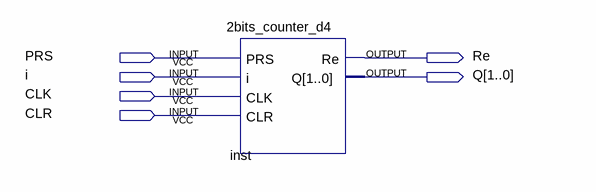
[diagram p0: schematic sheet]
// Quartus schematic test2.bdf as structural Verilog: 1 symbols, 6 pins
module test2 (
  input  PRS,
  input  i,
  input  CLK,
  input  CLR,
  output Re,
  output [1:0] Q
);

  \2bits_counter_d4  inst (.PRS(PRS), .i(i), .CLK(CLK), .CLR(CLR), .Re(Re), .Q(Q));
endmodule
